# EasyEDA Pro project ProPrj_Xen_2025-02-04.epro, board Power_PCB
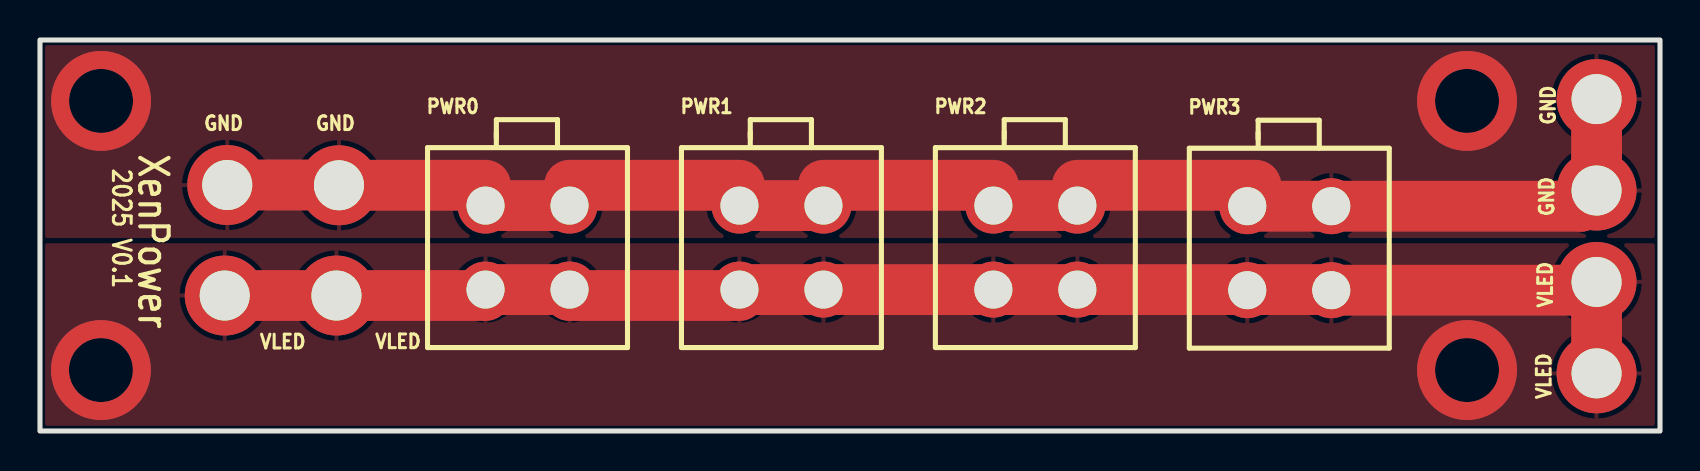
[diagram p34: board, top side]
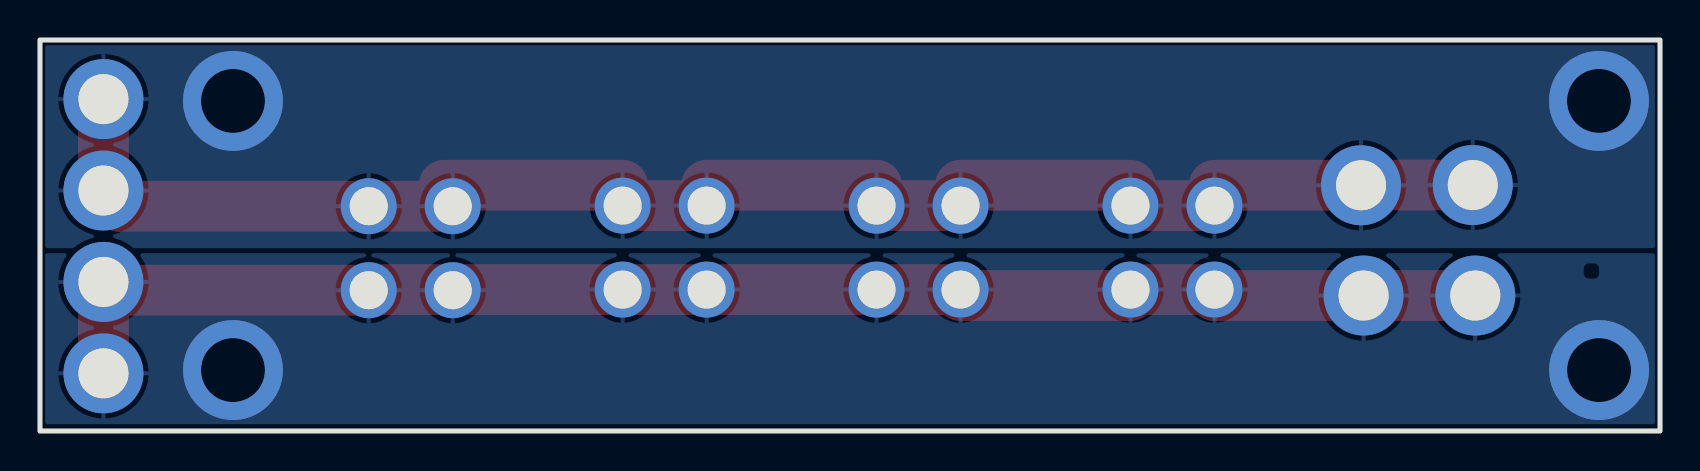
[diagram p35: board, bottom side, seen from below]

Outline 81.03 x 19.56 mm; copper layers: Top Layer, Bottom Layer. Coordinates in mm from the lower left corner of the outline.
Outline path: rectangle 0,19.56 81.03,0
Stack: Top Layer 0.035mm / Dielectric1 1.51mm FR4 er 4.5 / Bottom Layer 0.035mm

## Design rules (mm)
template: Custom Config
spacing copperThickness1oz (default): track to track 0.102, other pairs 0.152 to 0.3
spacing copperThickness2oz: track to track 0.203, other pairs 0.152 to 0.3
track width copperThickness1oz (default): min 2.54, default 2.54, max 2.54
track width copperThickness2oz: min 2.54, default 2.54, max 2.54
differential pair differentialPair (default): width min 0.127, default 0.254, max 2.54; gap min 0.152, default 0.152
via viaSize (default): diameter min 0.5, default 0.61, max 10; hole min 0.3, default 0.305, max 6.3

## Placement (name value [footprint] x y rotation side)
GND  -  [VIA]  9.37 12.3 90 top
GND#2  -  [VIA]  14.95 12.29 90 top
GND#3  -  [VIA]  77.85 12.03 270 top
GND#4  -  [VIA]  77.85 16.6 270 top
PWR0  HC-5557-2*2A  [CONN-TH_HAA420A-4A]  24.38 9.17 0 top
PWR1  HC-5557-2*2A  [CONN-TH_HAA420A-4A]  37.08 9.17 0 top
PWR2  HC-5557-2*2A  [CONN-TH_HAA420A-4A]  49.78 9.17 0 top
PWR3  HC-5557-2*2A  [CONN-TH_HAA420A-4A]  62.48 9.14 0 top
VLED  -  [VIA]  14.83 6.78 270 top
VLED#2  -  [VIA]  77.85 7.46 90 top
VLED#3  -  [VIA]  77.85 2.88 90 top
VLED#4  -  [VIA]  9.24 6.78 270 top

## Footprints (pads in the part's own frame, mm; a bottom-side part is the same pattern mirrored in y, then rotated)
CONN-TH_HAA420A-4A
  round 2.8 hole 1.9: 1(-2.1,-2.1) 2(-2.1,2.1) 3(2.1,-2.1) 4(2.1,2.1)
VIA
  round 4 hole 2.5: 1(0,0)

## Nets
A: GND.1 GND#2.1 GND#3.1 GND#4.1 PWR0.2 PWR0.4 PWR1.2 PWR1.4 PWR2.2 PWR2.4 PWR3.2 PWR3.4
C: PWR0.1 PWR0.3 PWR1.1 PWR1.3 PWR2.1 PWR2.3 PWR3.1 PWR3.3 VLED.1 VLED#2.1 VLED#3.1 VLED#4.1

## Via types
v1: diameter 5, hole 3.2, Top Layer to Bottom Layer, 4 vias

## Routing (per net, layer and track width the routed paths; a pad name or vN(x,y) marks a point on that pad's centre or on a via; arc(x,y) is an arc through that point)
A: length 73.8
  Top Layer w2.54: PWR3.2 PWR3.4 77.07,11.24 GND#3.1 GND#4.1 ; PWR2.2 PWR2.4 ; GND.1 14.94,12.3 GND#2.1 22.28,12.29 ; PWR1.2 PWR1.4 ; 39.18,12.29 47.68,12.29 ; 26.48,12.29 34.98,12.29 ; 51.88,12.29 60.82,12.29 ; PWR0.2 PWR0.4
  vias: v1(3.05,16.51) v1(71.37,16.51)
C: length 73.4
  Top Layer w2.54: PWR1.1 PWR1.3 PWR2.1 PWR2.3 64.55,7.07 PWR3.3 77.44,7.04 VLED#2.1 VLED#3.1 ; 22.28,6.78 VLED.1 VLED#4.1 ; PWR0.1 PWR0.3 ; 26.48,6.78 34.98,6.78
  vias: v1(3.05,3.05) v1(71.37,3.05)

## Copper pours and planes (outline as drawn; the poured copper is in the pictures)
A on Top Layer: -0.51,19.36 81.53,19.36 81.53,9.65 -0.51,9.65
A on Bottom Layer: 0,19.3 81.02,19.3 81.02,9.14 0,9.14
C on Top Layer: -0.25,10.16 81.53,10.16 81.53,0.25 -0.25,0.25
C on Bottom Layer: -0.25,9.4 0,9.4 0,0.34 -0.25,0.34
C on Bottom Layer: 0,9.65 81.02,9.65 81.02,0.34 0,0.34

Small or netless copper shapes (teardrops, artwork), in the pictures only: 1 on Bottom Layer

## Text on the board
Top Silkscreen Layer: 2025 V0.1 | XenPower
